# Altium schematic sheet ver061_MCU.SchDoc
size A3; SheetNumber: 3; SheetTotal: 6
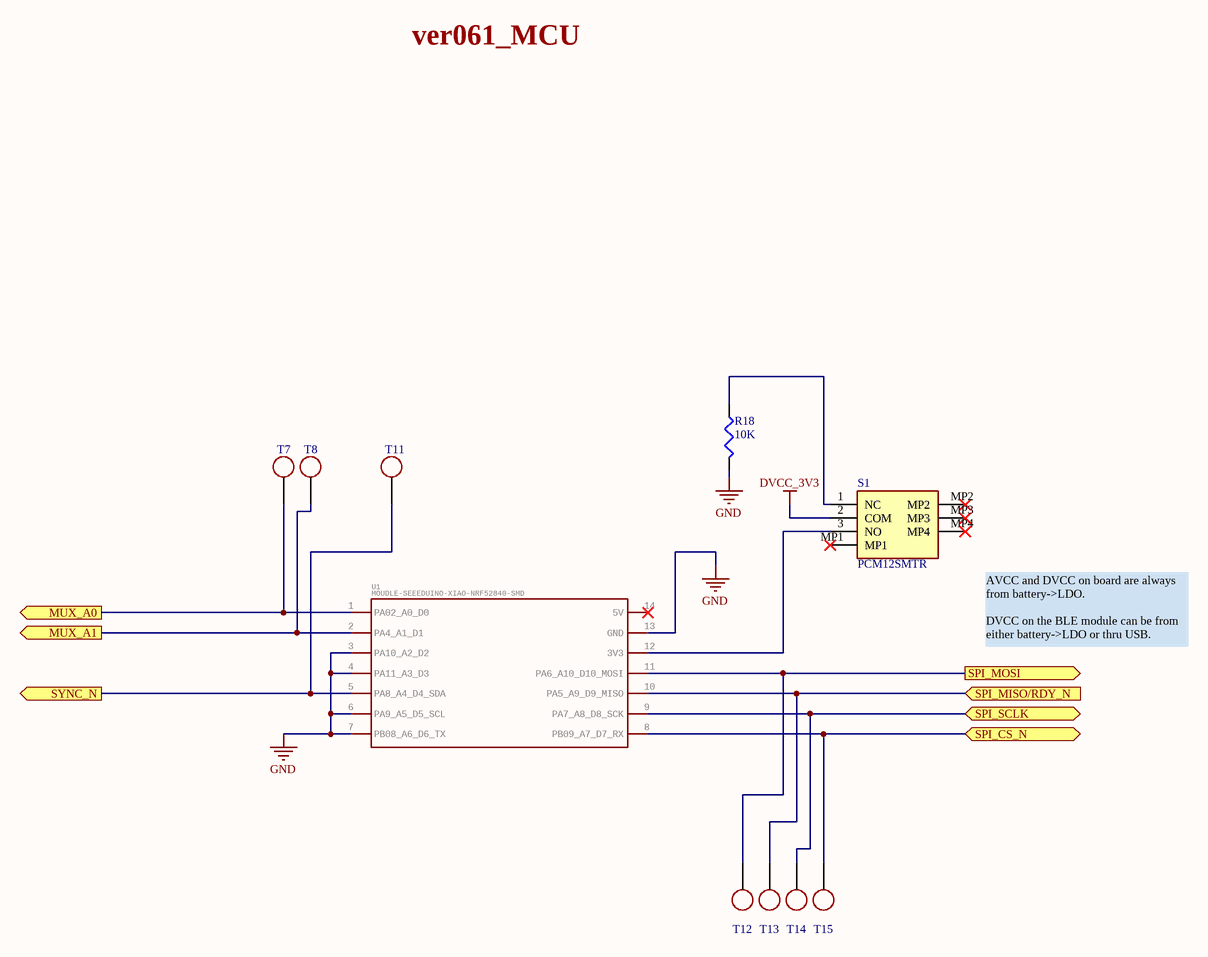
[diagram p0: ver061_MCU.SchDoc]

## Parts
R18  value 10K  [RESC1005X35N]  (hidden comment: Res3)
S1  PCM12SMTR  [PCM12SMTR]
T7  TP_SMT  [TP_SMT_Round_0.6x0.6]  (value not drawn)
T8  TP_SMT  [TP_SMT_Round_0.6x0.6]  (value not drawn)
T11  TP_SMT  [TP_SMT_Round_0.6x0.6]  (value not drawn)
T12  TP_SMT  [TP_SMT_Round_0.6x0.6]  (value not drawn)
T13  TP_SMT  [TP_SMT_Round_0.6x0.6]  (value not drawn)
T14  TP_SMT  [TP_SMT_Round_0.6x0.6]  (value not drawn)
T15  TP_SMT  [TP_SMT_Round_0.6x0.6]  (value not drawn)
U1  MOUDLE-SEEEDUINO-XIAO-NRF52840-SMD  [MOUDLE16P-SMD-2-54-21X17-8MM]

## Ports
MUX_A0 (out), MUX_A1 (out), SPI_CS_N (bidir), SPI_MISO/RDY_N (in), SPI_MOSI (out), SPI_SCLK (bidir), SYNC_N (out)

## Nets
DVCC_3V3: S1.2(COM)
GND: R18.2 U1.3(PA10_A2_D2) U1.4(PA11_A3_D3) U1.6(PA9_A5_D5_SCL) U1.7(PB08_A6_D6_TX) U1.13(GND)
MUX_A0: T7.1 U1.1(PA02_A0_D0) ; port MUX_A0
MUX_A1: T8.1 U1.2(PA4_A1_D1) ; port MUX_A1
SPI_CS_N: T15.1 U1.8(PB09_A7_D7_RX) ; port SPI_CS_N
SPI_MISO/RDY_N: T13.1 U1.10(PA5_A9_D9_MISO) ; port SPI_MISO/RDY_N
SPI_MOSI: T12.1 U1.11(PA6_A10_D10_MOSI) ; port SPI_MOSI
SPI_SCLK: T14.1 U1.9(PA7_A8_D8_SCK) ; port SPI_SCLK
SYNC_N: T11.1 U1.5(PA8_A4_D4_SDA) ; port SYNC_N
NetR18_1: R18.1 S1.1(NC)
NetS1_3: S1.3(NO) U1.12(3V3)

Not connected (* = marked no-connect by the designer): S1 MP1* MP2* MP3* MP4*; U1 14(5V)*

## Notes on the sheet
- ver061_MCU
- AVCC and DVCC on board are always from battery->LDO.
  DVCC on the BLE module can be from  either battery->LDO or thru USB.

## Library data of the parts
R18 = Res3: Resistor; Published: 8-Jun-2000; LatestRevisionDate: 29-May-2009; LatestRevisionNote: IPC-7351 Footprint Added.; PackageReference: J1-0603; Publisher: Altium Limited; PackageDescription: Chip Resistor
S1 = PCM12SMTR: Switch; Manufacturer_Name: C & K COMPONENTS; Datasheet Link: https://www.ckswitches.com/media/1424/pcm.pdf; Height: 1.4mm; Manufacturer_Part_Number: PCM12SMTR; Mouser Part Number: 611-PCM12SMTR; Mouser Price/Stock: https://www.mouser.co.uk/ProductDetail/CK/PCM12SMTR?qs=mfFuHy8STfL3qrPSfCHA7w%3D%3D; Arrow Part Number: PCM12SMTR; Arrow Price/Stock: https://www.arrow.com/en/products/pcm12smtr/ck?region=nac
U1 = MOUDLE-SEEEDUINO-XIAO-NRF52840-SMD: GateName_1: G$1; DeviceName: -SMD; SymbolName_1: MOUDLE-SEEEDUINO-XIAO-NRF52840; LibraryName: Seeed-Studio-XIAO-nRF52840-footprint-eagle; DeviceSetName: MOUDLE-SEEEDUINO-XIAO-NRF52840; Package: MOUDLE16P-SMD-2.54-21X17.8MM